# Altium schematic sheet SolderingStation_Power.SchDoc
size A4
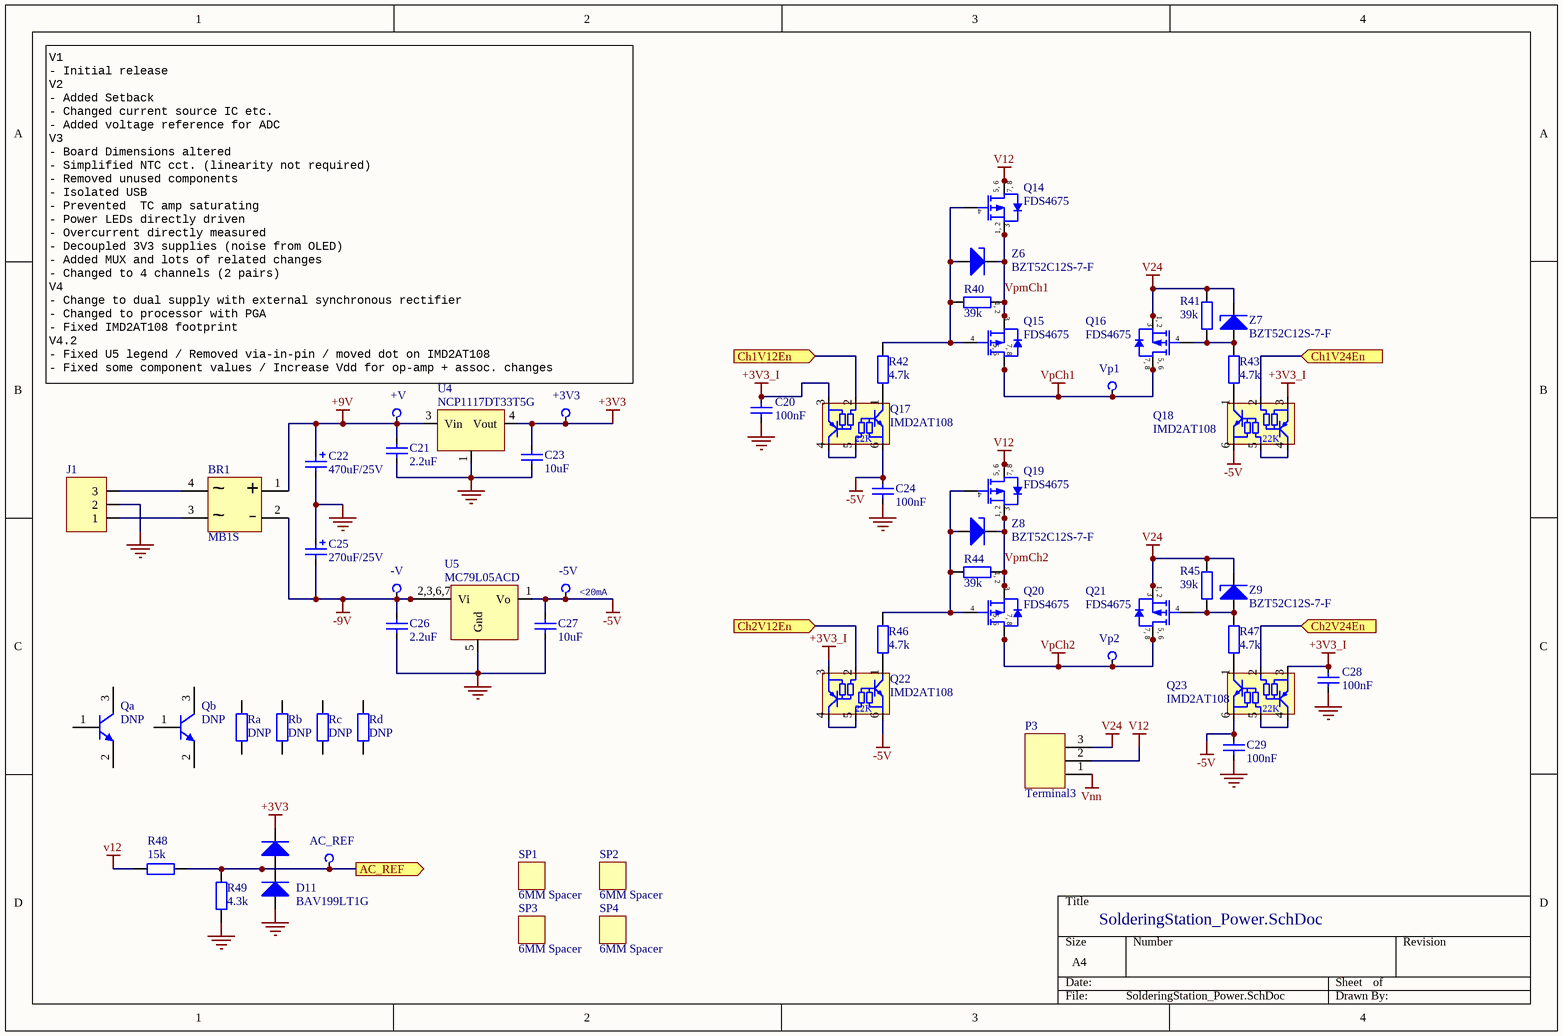
[diagram p0: SolderingStation_Power.SchDoc]

## Parts
+3V3  +3.3 volt  [PCBPIN - 0.9mm]  (value not drawn)  (no BOM)
+V  9 volt unregulated  [PCBPIN - 0.9mm]  (value not drawn)  (no BOM)
-5V  -5 volt  [PCBPIN - 0.9mm]  (value not drawn)  (no BOM)
-V  -9 volt unregulated  [PCBPIN - 0.9mm]  (value not drawn)  (no BOM)
AC_REF  Vdd  [PCBPIN - 0.9mm]  (value not drawn)  (no BOM)
BR1  MB1S  [MB1S]
C20  100nF  [CCNP1608-0603_N]
C21  2.2uF  [CCNP2012-0805]
C22  470uF/25V  [RB5/10x13mm]
C23  10uF  [CCNP2012-0805]
C24  100nF  [CCNP1608-0603_N]
C25  270uF/25V  [RB5/10x13mm]
C26  2.2uF  [CCNP2012-0805]
C27  10uF  [CCNP2012-0805]
C28  100nF  [CCNP1608-0603_N]
C29  100nF  [CCNP1608-0603_N]
D11  BAV199LT1G  [SOT23_M]
J1  JST XH Connector, 3-Pin  [jst-b3b-xh-ax]  (value not drawn)
P3  Terminal3  [MOLEX-39544-3003]
Q14  FDS4675  [SO-8_M]
Q15  FDS4675  [SO-8_M]
Q16  FDS4675  [SO-8_M]
Q17  IMD2AT108  [SOT457_M - MIRROR]
Q18  IMD2AT108  [SOT457_M - MIRROR]
Q19  FDS4675  [SO-8_M]
Q20  FDS4675  [SO-8_M]
Q21  FDS4675  [SO-8_M]
Q22  IMD2AT108  [SOT457_M - MIRROR]
Q23  IMD2AT108  [SOT457_M - MIRROR]
Qa  DNP  [SOT23_M]  (no BOM)
Qb  DNP  [SOT23_M]  (no BOM)
R40  39k  [CR1608-0603_N]
R41  39k  [CR1608-0603_N]
R42  4.7k  [CR1608-0603_N]
R43  4.7k  [CR1608-0603_N]
R44  39k  [CR1608-0603_N]
R45  39k  [CR1608-0603_N]
R46  4.7k  [CR1608-0603_N]
R47  4.7k  [CR1608-0603_N]
R48  15k  [CR1608-0603_N]
R49  4.3k  [CR1608-0603_N]
Ra  DNP  [CR1608-0603_N]  (no BOM)
Rb  DNP  [CR1608-0603_N]  (no BOM)
Rc  DNP  [CR1608-0603_N]  (no BOM)
Rd  DNP  [CR1608-0603_N]  (no BOM)
SP1  6MM Spacer  [Spacer-2mm dia x 6mm]
SP2  6MM Spacer  [Spacer-2mm dia x 6mm]
SP3  6MM Spacer  [Spacer-2mm dia x 6mm]
SP4  6MM Spacer  [Spacer-2mm dia x 6mm]
U4  NCP1117DT33T5G  [TO-252]
U5  MC79L05ACD  [SOIC127P600-8N]
Vp1  VpCH1  [PCBPIN - 0.9mm]  (value not drawn)  (no BOM)
Vp2  VpCh2  [PCBPIN - 0.9mm]  (value not drawn)  (no BOM)
Z6  BZT52C12S-7-F  [SOD-323]
Z7  BZT52C12S-7-F  [SOD-323]
Z8  BZT52C12S-7-F  [SOD-323]
Z9  BZT52C12S-7-F  [SOD-323]

## Ports
AC_REF (out), Ch1V12En (in), Ch1V24En (in), Ch2V12En (in), Ch2V24En (in)

## Nets
+3V3: +3V3.1(TP) C23.2 D11.2(A2) U4.4(Vout)
+3V3_I: C20.1 C28.1 Q17.3(E2) Q18.3(E2) Q22.3(E2) Q23.3(E2)
+9V: +V.1(TP) BR1.1 C21.2 C22.1 U4.3(Vin)
-5V: -5V.1(TP) C24.1 C27.2 C29.1 Q17.6(E1) Q18.6(E1) Q22.6(E1) Q23.6(E1) U5.1(Vo)
-9V: -V.1(TP) BR1.2 C25.2 C26.2 U5.2(Vi) U5.3(Vi) U5.6(Vi) U5.7(Vi)
GND: C20.2 C21.1 C22.2 C23.1 C24.2 C25.1 C26.1 C27.1 C28.2 C29.2 D11.1(A1) J1.2 R49.1 U4.1(Gnd) U5.5(Gnd)
v12: P3.2 Q14.5(D) Q14.6(D) Q14.7(D) Q14.8(D) Q19.5(D) Q19.6(D) Q19.7(D) Q19.8(D) R48.1
V24: P3.3 Q16.1(S) Q16.2(S) Q16.3(S) Q21.1(S) Q21.2(S) Q21.3(S) R41.2 R45.2 Z7.K Z9.K
Vnn: P3.1
VpCh1: Q15.5(D) Q15.6(D) Q15.7(D) Q15.8(D) Q16.5(D) Q16.6(D) Q16.7(D) Q16.8(D) Vp1.1(TP)
VpCh2: Q20.5(D) Q20.6(D) Q20.7(D) Q20.8(D) Q21.5(D) Q21.6(D) Q21.7(D) Q21.8(D) Vp2.1(TP)
AC_REF: AC_REF.1(TP) D11.3(K) R48.2 R49.2 ; port AC_REF
Ch1V12En: Q17.2(B2) ; port Ch1V12En
Ch1V24En: Q18.2(B2) ; port Ch1V24En
Ch2V12En: Q22.2(B2) ; port Ch2V12En
Ch2V24En: Q23.2(B2) ; port Ch2V24En
VpmCh1: Q14.1(S) Q14.2(S) Q14.3(S) Q15.1(S) Q15.2(S) Q15.3(S) R40.1 Z6.K
VpmCh2: Q19.1(S) Q19.2(S) Q19.3(S) Q20.1(S) Q20.2(S) Q20.3(S) R44.2 Z8.K
NetBR1_3: BR1.3 J1.1
NetBR1_4: BR1.4 J1.3
NetQ14_4: Q14.4(G) Q15.4(G) R40.2 R42.2 Z6.A
NetQ16_4: Q16.4(G) R41.1 R43.2 Z7.A
NetQ17_1: Q17.1(C1) R42.1
NetQ17_4: Q17.4(C2) Q17.5(B1)
NetQ18_1: Q18.1(C1) R43.1
NetQ18_4: Q18.4(C2) Q18.5(B1)
NetQ19_4: Q19.4(G) Q20.4(G) R44.1 R46.2 Z8.A
NetQ21_4: Q21.4(G) R45.1 R47.2 Z9.A
NetQ22_1: Q22.1(C1) R46.1
NetQ22_4: Q22.4(C2) Q22.5(B1)
NetQ23_1: Q23.1(C1) R47.1
NetQ23_4: Q23.4(C2) Q23.5(B1)

Not connected (* = marked no-connect by the designer): Qa 1(B) 2(E) 3(C); Qb 1(B) 2(E) 3(C); Ra 1 2; Rb 1 2; Rc 1 2; Rd 1 2; U5 4(NC) 8(NC)

## Notes on the sheet
- V1
  - Initial release
  V2
  - Added Setback
  - Changed current source IC etc.
  - Added voltage reference for ADC
  V3
  - Board Dimensions altered
  - Simplified NTC cct. (linearity not required)
  - Removed unused components
  - Isolated USB
  - Prevented  TC amp saturating
  - Power LEDs directly driven
  - Overcurrent directly measured
  - Decoupled 3V3 supplies (noise from OLED)
  - Added MUX and lots of related changes
  - Changed to 4 channels (2 pairs)
  V4
  - Change to dual supply with external synchronous rectifier
  - Changed to processor with PGA
  - Fixed IMD2AT108 footprint
  V4.2
  - Fixed U5 legend / Removed via-in-pin / moved dot on IMD2AT108
  - Fixed some component values / Increase Vdd for op-amp + assoc. changes
- (near -5V) <20mA
- (in symbol FDS4675) 1, 2; 5, 6; 7, 8
- (in symbol IMD2AT108) 22K
- (in symbol MB1S) ~; +; -
- (in symbol MC79L05ACD) 2,3,6,7

## Library data of the parts
+3V3 +V -5V -V AC_REF Vp1 Vp2 = TP: Test Point; Digikey: *; Farnell PN: *; LCSC: *
BR1 = MB1S: Bridge Rectifier Diode, Single Phase, 100 V, 800 mA, SOIC, 1.1 V, 4 Pins; LCSC: C232821
C20 C24 C28 C29 = Cap_CCNP_0603_100nF: Capacitor non-polar SMT 0603; Manufacturer: Generic Components; Class: Passive; Published: 08/06/2000; Publisher: Altium Hobart Technology Centre; SubClass: Capacitor; Farnell PN: *; Digikey: *; Value: 100nF; LCSC: C14663
C21 C26 = Cap_CCNP_0805_2u2F: Capacitor non-polar SMT 0805; Manufacturer: Generic Components; Class: Passive; Published: 08/06/2000; Publisher: Altium Hobart Technology Centre; SubClass: Capacitor; Farnell PN: *; Digikey: *; LCSC: C49217; Value: 2.2uF
C22 C25 = Cap-RB5/10x16MM
  C22: value: 470uF/25V
  C25: value: 270uF/25V
C23 C27 = Cap_CCNP_0805_10uF: Capacitor non-polar SMT 0805; Manufacturer: Generic Components; Class: Passive; Published: 08/06/2000; Publisher: Altium Hobart Technology Centre; SubClass: Capacitor; Farnell PN: *; Digikey: *; Value: 10uF; LCSC: C15850
D11 = BAV199LT1G: Dual Series low-leakage switching diodes, 3-Pin SOT-23; Digikey: BAV199LT1GOSCT-ND; Farnell PN: 1431115; LCSC: C145516
J1 = JST-B3B-XH-A: LatestRevisionDate: 17-Jul-2002; LatestRevisionNote: Re-released for DXP Platform.; Publisher: Altium Limited; LCSC: *; Farnell PN: 1516277; Digikey: 455-2248-ND
P3 = Terminal3: MULTICOMP MC24367 Wire-To-Board Terminal Block; Farnell PN: *; LCSC: *
Q14-Q16 Q19-Q21 = FDS4675: P-Channel Power MOSFET, 11 A, 40 V, RDS(ON) = 0.013 ohm @ VGS = -10   VRDS(ON) = 0.017 ohm @ VGS =   -4.5 VC; Manufacturer: Fairchild Semiconductor; Package Version: Rev. 16, 08/2015; Qg Gate Charge: 56nC; Drain-to-Source Voltage [Vdss]: 40V; Drain-Source On Resistance-Max: 13mO; Rated Power Dissipation: 2.4W; Datasheet Version: Rev. C(W), 02/2001; Package Description: 8-Pin Small Outline Integrated Circuit, Body 4.9 x 3.9 mm, Pitch 1.27 mm; Channel Type: P-Channel; Datasheet URL: https://www.fairchildsemi.com/datasheets/FD/FDS4675.pdf; Package URL: https://www.fairchildsemi.com/package-drawings/M0/M08A.pdf; Package Reference: SO-8; Mounting Technology: SurfaceMount; Manufacturer URL: https://www.fairchildsemi.com/; Temperature: 25
Q17 Q18 Q22 Q23 = IMD2AT108: Pre-Biased NPN and PNP pair, 50 V, 100 mA, 22 kohm, 22 kohm; LCSC: C509889; Farnell PN: 1680329
Qa Qb = MMBT3904LT1G: SOT23; ComponentLink2Description: Datasheet; ComponentLink2URL: http://www.onsemi.cn/pub_link/Collateral/MMBT3904LT1-D.PDF; ComponentLink1URL: http://www.onsemi.com/; ComponentLink3Description: Package Specification; ComponentLink1Description: Manufacturer URL; ComponentLink3URL: http://www.onsemi.cn/pub_link/Collateral/318-08.PDF
R40 R41 R44 R45 = Res_CR0603_39k: Resistor SMT 0603; Manufacturer: Generic Components; Class: Passive; Published: 08/06/2000; Publisher: Altium Hobart Technology Centre; SubClass: Resistor; Farnell PN: *; Digikey: *; LCSC: C23153; Value: 39k
R42 R43 R46 R47 = Res_CR0603_4k7: Resistor SMT 0603; Manufacturer: Generic Components; Class: Passive; Published: 08/06/2000; Publisher: Altium Hobart Technology Centre; SubClass: Resistor; Farnell PN: *; Digikey: *; LCSC: C23162; Value: 4.7k
R48 = Res_CR0603_15k: Resistor SMT 0603; Manufacturer: Generic Components; Class: Passive; Published: 08/06/2000; Publisher: Altium Hobart Technology Centre; SubClass: Resistor; Farnell PN: *; Digikey: *; LCSC: C22809; Value: 15k
R49 = Res_CR0603_4k3: Resistor SMT 0603; Manufacturer: Generic Components; Class: Passive; Published: 08/06/2000; Publisher: Altium Hobart Technology Centre; SubClass: Resistor; Farnell PN: *; Digikey: *; LCSC: C23159; Value: 4.3k
Ra Rb Rc Rd = Res_CR0603: Resistor SMT 0603; Manufacturer: Generic Components; Class: Passive; Published: 08/06/2000; Publisher: Altium Hobart Technology Centre; SubClass: Resistor; Farnell PN: *; Digikey: *; Value: DNP
SP1-SP4 = Spacer-6mm
U4 = NCP1117DT33T5G: IC REG LINEAR +3V3 1A TO252-3; Farnel: 2464254; DigiKey: NCP1117DT33T5GOSCT-ND; LCSC: C152529
U5 = MC79L05ACD: IC REG LINEAR -5V 100MA SOIC-8; DigiKey: UA79M05CKVURG3; LCSC: C154823; Farnell PN: 3122804
Z6-Z9 = BZT52C12S-7-F: Surface Mount Zener Diode, 12-13 V, -65 to 150 degC, SOD-123; LCSC: C124208